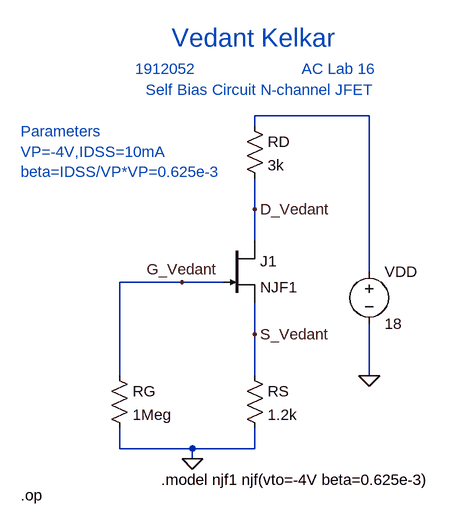
[diagram p0: schematic Draft36.asc]
Draft36.asc, the LTspice schematic file:
Version 4
SHEET 1 880 792
WIRE 384 192 208 192
WIRE 208 208 208 192
WIRE 208 336 208 288
WIRE 208 384 208 336
WIRE 384 432 384 192
WIRE 96 448 0 448
WIRE 160 448 96 448
WIRE 208 528 208 480
WIRE 0 592 0 448
WIRE 208 592 208 528
WIRE 384 592 384 512
WIRE 0 704 0 672
WIRE 112 704 0 704
WIRE 208 704 208 672
WIRE 208 704 112 704
WIRE 112 720 112 704
FLAG 208 336 D_Vedant
FLAG 96 448 G_Vedant
FLAG 208 528 S_Vedant
FLAG 384 592 0
FLAG 112 720 0
SYMBOL res -16 576 R0
SYMATTR InstName RG
SYMATTR Value 1Meg
SYMBOL njf 160 384 R0
SYMATTR InstName J1
SYMATTR Value NJF1
SYMBOL res 192 192 R0
SYMATTR InstName RD
SYMATTR Value 3k
SYMBOL res 192 576 R0
SYMATTR InstName RS
SYMATTR Value 1.2k
SYMBOL voltage 384 416 R0
WINDOW 123 0 0 Left 0
WINDOW 39 0 0 Left 0
SYMATTR InstName VDD
SYMATTR Value 18
TEXT 80 72 Left 4 ;Vedant Kelkar
TEXT 24 120 Left 2 ;1912052
TEXT 280 120 Left 2 ;AC Lab 16
TEXT 40 152 Left 2 ;Self Bias Circuit N-channel JFET
TEXT -152 216 Left 2 ;Parameters\nVP=-4V,IDSS=10mA\nbeta=IDSS/VP*VP=0.625e-3
TEXT 64 752 Left 2 !.model njf1 njf(vto=-4V beta=0.625e-3)
TEXT -152 776 Left 2 !.op

The netlist it stands for:
* Draft36.asc
RG G_Vedant 0 1Meg
J1 D_Vedant G_Vedant S_Vedant NJF1
RD N001 D_Vedant 3k
RS S_Vedant 0 1.2k
VDD N001 0 18
.model NJF NJF
.model PJF PJF
.lib standard.jft
* Vedant Kelkar
* 1912052
* AC Lab 16
* Self Bias Circuit N-channel JFET
* Parameters
* VP=-4V,IDSS=10mA
* beta=IDSS/VP*VP=0.625e-3
.model njf1 njf(vto=-4V beta=0.625e-3)
.op
.backanno
.end